# EAGLE design Arduino Nano Servo Control Shield (EAGLE 9.6.2)
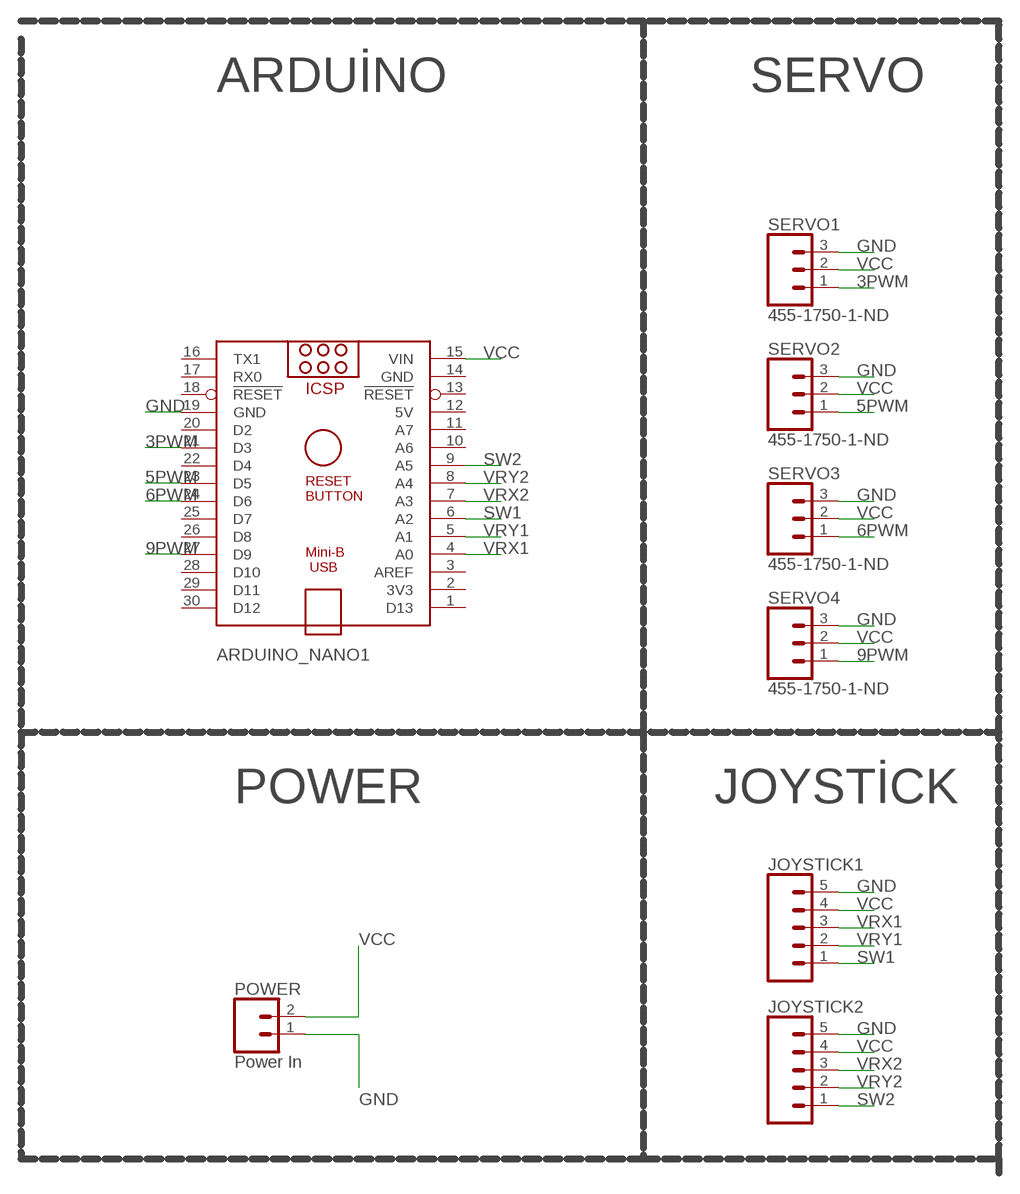
[diagram p0: schematic, sheet 1]

## Parts
ARDUINO_NANO1  ARDUINO_NANO  [ARDUINO_NANO]
JOYSTICK1  CONN_05PTH  [1X05]
JOYSTICK2  CONN_05PTH  [1X05]
POWER  Power In  CONN_023.5MM  [SCREWTERMINAL-3.5MM-2]
SERVO1  455-1750-1-ND  CONN_03  [1X03]
SERVO2  455-1750-1-ND  CONN_03  [1X03]
SERVO3  455-1750-1-ND  CONN_03  [1X03]
SERVO4  455-1750-1-ND  CONN_03  [1X03]

## Nets
3PWM: ARDUINO_NANO1.21(D3) SERVO1.1
5PWM: ARDUINO_NANO1.23(D5) SERVO2.1
6PWM: ARDUINO_NANO1.24(D6) SERVO3.1
9PWM: ARDUINO_NANO1.27(D9) SERVO4.1
GND: ARDUINO_NANO1.19(GND) JOYSTICK1.5 JOYSTICK2.5 POWER.1 SERVO1.3 SERVO2.3 SERVO3.3 SERVO4.3
SW1: ARDUINO_NANO1.6(A2) JOYSTICK1.1
SW2: ARDUINO_NANO1.9(A5) JOYSTICK2.1
VCC: ARDUINO_NANO1.15(VIN) JOYSTICK1.4 JOYSTICK2.4 POWER.2 SERVO1.2 SERVO2.2 SERVO3.2 SERVO4.2
VRX1: ARDUINO_NANO1.4(A0) JOYSTICK1.3
VRX2: ARDUINO_NANO1.7(A3) JOYSTICK2.3
VRY1: ARDUINO_NANO1.5(A1) JOYSTICK1.2
VRY2: ARDUINO_NANO1.8(A4) JOYSTICK2.2
Unconnected: ARDUINO_NANO1.1(D13) ARDUINO_NANO1.2(3V3) ARDUINO_NANO1.3(AREF) ARDUINO_NANO1.10(A6) ARDUINO_NANO1.11(A7) ARDUINO_NANO1.13(!RESET) ARDUINO_NANO1.16(TX1) ARDUINO_NANO1.17(RX0) ARDUINO_NANO1.18(!RESET) ARDUINO_NANO1.20(D2) ARDUINO_NANO1.22(D4) ARDUINO_NANO1.25(D7) ARDUINO_NANO1.26(D8) ARDUINO_NANO1.28(D10) ARDUINO_NANO1.29(D11) ARDUINO_NANO1.30(D12)

## Notes on the sheet
- ARDUİNO | SERVO
- POWER | JOYSTİCK

## Power pins joined to a net without a drawn wire
GND: ARDUINO_NANO1.14(GND)
VCC: ARDUINO_NANO1.12(5V)

## Library data of the parts
ARDUINO_NANO1 = ArduinoNanoV30:ARDUINO_NANO: Arduino Nano V3.0 Overview: The Arduino Nano is a small, complete, and breadboard-friendly board based on the ATmega328 (Arduino Nano 3.x) or ATmega168 (Arduino Nano 2.x). It has more or less the same functionality of the Arduino Duemilanove, but in a different package. It lacks only a DC power jack, and works with a Mini-B USB cable instead of a standard one. The Nano was designed and is being produced by Gravitech. Specifications: Microcontroller Atmel ATmega168 or ATmega328 Operating Voltage (logic level) 5 V Input Voltage (recommended) 7-12 V Input Voltage (limits) 6-20 V Digital I/O Pins 14 (of which 6 provide PWM output) Analog Input Pins 8 DC Current per I/O Pin 40 mA Flash Memory 16 KB (ATmega168) or 32 KB (ATmega328) of which 2 KB used by bootloader SRAM 1 KB (ATmega168) or 2 KB (ATmega328) EEPROM 512 bytes (ATmega168) or 1 KB (ATmega328) Clock Speed 16 MHz Dimensions 0.73" x 1.70" Length 45 mm Width 18 mm Weigth 5 g Power: The Arduino Nano can be powered via the Mini-B USB connection, 6-20V unregulated external power supply (pin 30), or 5V regulated external power supply (pin 27). The power source is automatically selected to the highest voltage source. Memory: The ATmega168 has 16 KB of flash memory for storing code (of which 2 KB is used for the bootloader); the ATmega328 has 32 KB, (also with 2 KB used for the bootloader). The ATmega168 has 1 KB of SRAM and 512 bytes of EEPROM (which can be read and written with the EEPROM library); the ATmega328 has 2 KB of SRAM and 1 KB of EEPROM. Input and Output: Each of the 14 digital pins on the Nano can be used as an input or output, using pinMode(), digitalWrite(), and digitalRead() functions. They operate at 5 volts. Each pin can provide or receive a maximum of 40 mA and has an internal pull-up resistor (disconnected by default) of 20-50 kOhms. In addition, some pins have specialized functions. Visit Arduino - ArduinoBoardNano <https://www.arduino.cc/en/Main/ArduinoBoardNano>
JOYSTICK1 JOYSTICK2 = SparkFun-Connectors:CONN_05: Multi connection point. Often used as Generic Header-pin footprint for 0.1 inch spaced/style header connections On any of the 0.1 inch spaced packages, you can populate with these: Break Away Headers - Straight <https://www.sparkfun.com/products/116> (PRT-00116) Break Away Male Headers - Right Angle <https://www.sparkfun.com/products/553> (PRT-00553) Female Headers <https://www.sparkfun.com/products/115> (PRT-00115) Break Away Headers - Machine Pin <https://www.sparkfun.com/products/117> (PRT-00117) Break Away Female Headers - Swiss Machine Pin <https://www.sparkfun.com/products/743> (PRT-00743) For SCREWTERMINALS and SPRING TERMINALS visit here: Screw Terimnals on SparkFun.com <https://www.sparkfun.com/search/results?term=Screw+Terminals> (5mm/3.5mm/2.54mm spacing) This device is also useful as a general connection point to wire up your design to another part of your project. Our various solder wires solder well into these plated through hole pads. Hook-Up Wire - Assortment (Stranded, 22 AWG) <https://www.sparkfun.com/products/11375> (PRT-11375) Hook-Up Wire - Assortment (Solid Core, 22 AWG) <https://www.sparkfun.com/products/11367> (PRT-11367) View the entire wire category on our website here <https://www.sparkfun.com/categories/141> Special notes: Molex polarized connector foot print use with SKU : PRT-08231 with associated crimp pins and housings. 1MM SMD Version SKU: PRT-10208
POWER = SparkFun-Connectors:CONN_02: Multi connection point. Often used as Generic Header-pin footprint for 0.1 inch spaced/style header connections On any of the 0.1 inch spaced packages, you can populate with these: Break Away Headers - Straight <https://www.sparkfun.com/products/116> (PRT-00116) Break Away Male Headers - Right Angle <https://www.sparkfun.com/products/553> (PRT-00553) Female Headers <https://www.sparkfun.com/products/115> (PRT-00115) Break Away Headers - Machine Pin <https://www.sparkfun.com/products/117> (PRT-00117) Break Away Female Headers - Swiss Machine Pin <https://www.sparkfun.com/products/743> (PRT-00743) For SCREWTERMINALS and SPRING TERMINALS visit here: Screw Terimnals on SparkFun.com <https://www.sparkfun.com/search/results?term=Screw+Terminals> (5mm/3.5mm/2.54mm spacing) This device is also useful as a general connection point to wire up your design to another part of your project. Our various solder wires solder well into these plated through hole pads. Hook-Up Wire - Assortment (Stranded, 22 AWG) <https://www.sparkfun.com/products/11375> (PRT-11375) Hook-Up Wire - Assortment (Solid Core, 22 AWG) <https://www.sparkfun.com/products/11367> (PRT-11367) View the entire wire category on our website here <https://www.sparkfun.com/categories/141> Special notes: Molex polarized connector foot print use with: PRT-08233 with associated crimp pins and housings. 2.54_SCREWTERM for use with PRT-10571. 3.5mm Screw Terminal footprints for PRT-08084 5mm Screw Terminal footprints for use with PRT-08432; PROD_ID: CONN-08399
SERVO1-SERVO4 = SparkFun-Connectors:CONN_03: Multi connection point. Often used as Generic Header-pin footprint for 0.1 inch spaced/style header connections On any of the 0.1 inch spaced packages, you can populate with these: Break Away Headers - Straight <https://www.sparkfun.com/products/116> (PRT-00116) Break Away Male Headers - Right Angle <https://www.sparkfun.com/products/553> (PRT-00553) Female Headers <https://www.sparkfun.com/products/115> (PRT-00115) Break Away Headers - Machine Pin <https://www.sparkfun.com/products/117> (PRT-00117) Break Away Female Headers - Swiss Machine Pin <https://www.sparkfun.com/products/743> (PRT-00743) Stackable Header - 3 Pin (Female, 0.1") <https://www.sparkfun.com/products/13875> (PRT-13875) For SCREWTERMINALS and SPRING TERMINALS visit here: Screw Terimnals on SparkFun.com <https://www.sparkfun.com/search/results?term=Screw+Terminals> (5mm/3.5mm/2.54mm spacing) This device is also useful as a general connection point to wire up your design to another part of your project. Our various solder wires solder well into these plated through hole pads. Hook-Up Wire - Assortment (Stranded, 22 AWG) <https://www.sparkfun.com/products/11375> (PRT-11375) Hook-Up Wire - Assortment (Solid Core, 22 AWG) <https://www.sparkfun.com/products/11367> (PRT-11367) View the entire wire category on our website here <https://www.sparkfun.com/categories/141> Special notes: Molex polarized connector foot print use with SKU : PRT-08232 with associated crimp pins and housings.; PROD_ID: XXX-00000

## Board
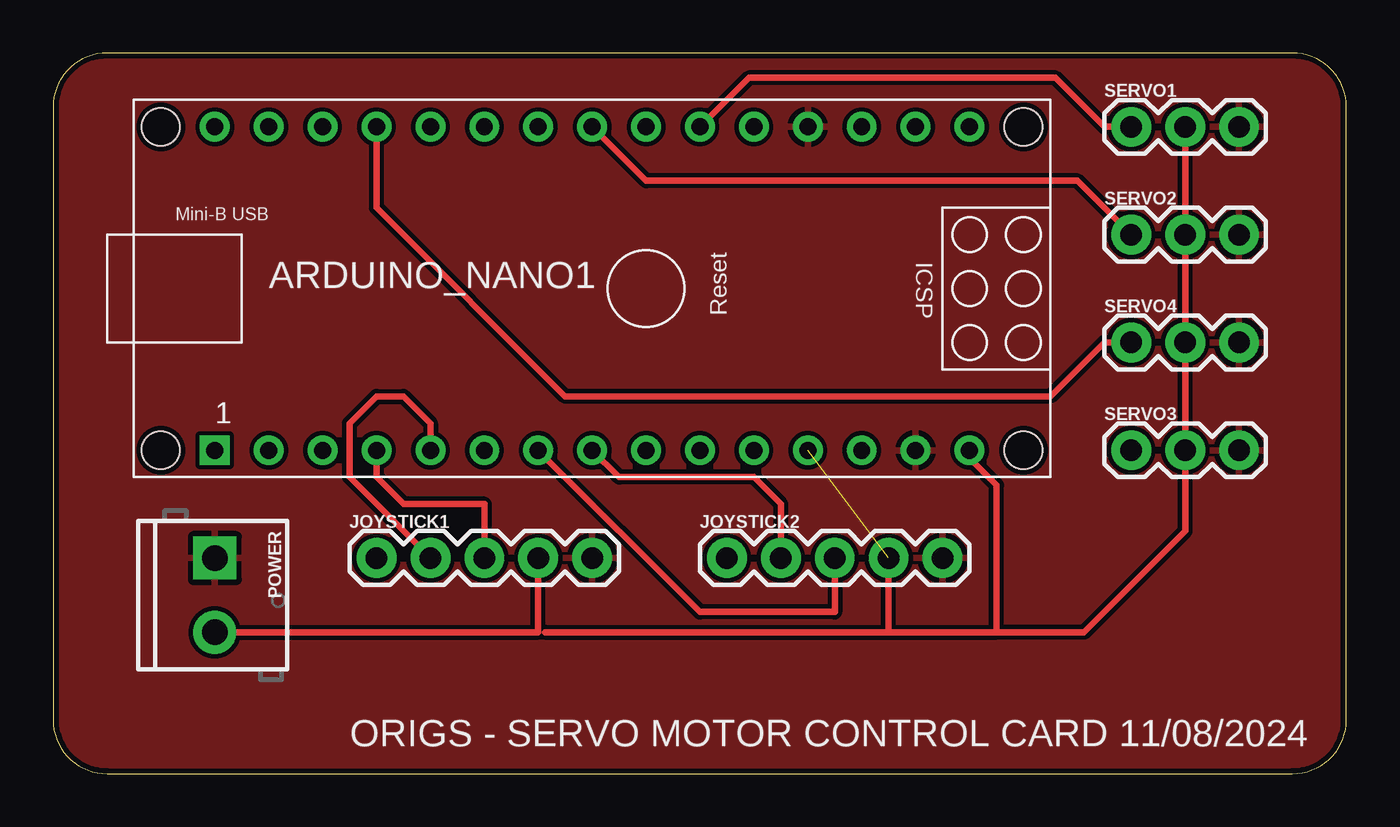
[diagram p1: board, top side]
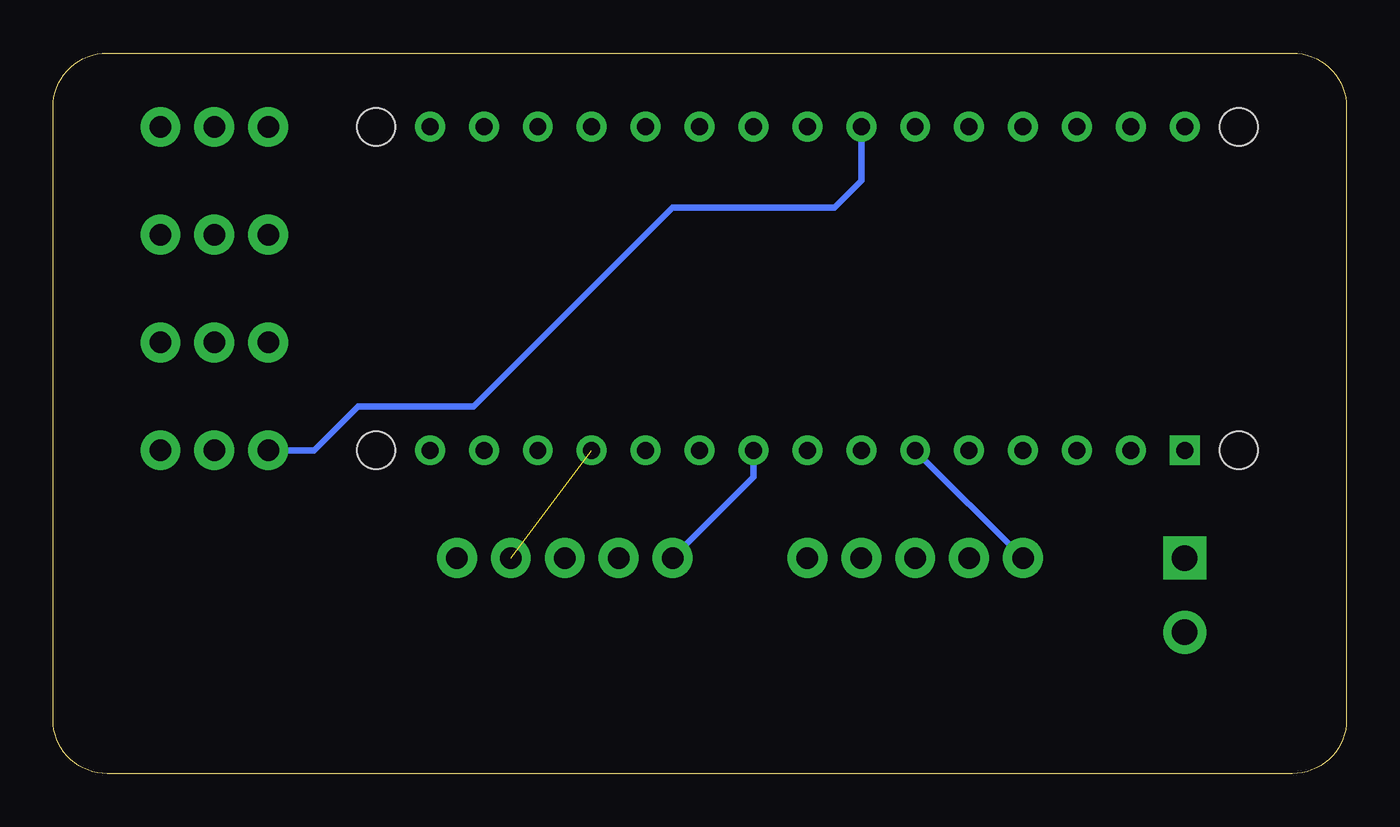
[diagram p2: board, bottom side, seen from below]

Size 60.94 x 33.96 mm. Coordinates in mm from the lower left corner, seen from the top.
Outline: 0,31.42 0,2.54 arc90 2.54,0 58.4,0 arc90 60.94,2.54 60.94,31.42 arc90 58.4,33.96 2.54,33.96 arc90 0,31.42
Copper layers (1*16): Top 0.035mm / dielectric 1.5mm / Bottom 0.035mm
Design rules "SparkFun": minimum track width 8mil, minimum drill 20mil, track to track 8mil, track to pad 8mil, pad to pad 8mil, via to via 8mil, smd to smd 8mil, copper to edge 10mil, drill to drill 8mil, minimum pad ring 12mil, minimum via ring 10mil, stop-mask expansion 4mil, vias tented up to drill 25mil, thermal gap 10mil

### Footprints (pad centres in the part's own frame; a part is rotated, then mirrored left to right if it is on the bottom)
ARDUINO_NANO = drill 0.8 square: 1 -20.32,-7.62 | drill 0.8: 2 -17.78,-7.62; 3 -15.24,-7.62; 4 -12.7,-7.62; 5 -10.16,-7.62; 6 -7.62,-7.62; 7 -5.08,-7.62; 8 -2.54,-7.62; 9 0,-7.62; 10 2.54,-7.62; 11 5.08,-7.62; 12 7.62,-7.62; 13 10.16,-7.62; 14 12.7,-7.62; 15 15.24,-7.62; 16 15.24,7.62; 17 12.7,7.62; 18 10.16,7.62; 19 7.62,7.62; 20 5.08,7.62; 21 2.54,7.62; 22 0,7.62; 23 -2.54,7.62; 24 -5.08,7.62; 25 -7.62,7.62; 26 -10.16,7.62; 27 -12.7,7.62; 28 -15.24,7.62; 29 -17.78,7.62; 30 -20.32,7.62 | hole 1.778: -22.86,-7.62; -22.86,7.62; 17.78,7.62; 17.78,-7.62
1X05 = drill 1.016 pad 1.88: 1 0,0; 2 2.54,0; 3 5.08,0; 4 7.62,0; 5 10.16,0
SCREWTERMINAL-3.5MM-2 = drill 1.2 pad 2.032 square: 1 0,0 | drill 1.2 pad 2.032: 2 3.5,0
1X03 = drill 1.016 pad 1.88: 1 0,0; 2 2.54,0; 3 5.08,0

### Placement (x,y rotation side)
ARDUINO_NANO1  27.94,22.86 0 top
JOYSTICK1  15.24,10.16 0 top
JOYSTICK2  31.75,10.16 0 top
POWER  7.62,10.16 270 top
SERVO1  50.8,30.48 0 top
SERVO2  50.8,25.4 0 top
SERVO3  50.8,15.24 0 top
SERVO4  50.8,20.32 0 top

### Tracks (layer width: path | path; a pad name or v marks a point on that pad's centre or on a via)
3PWM
  Top 0.305: SERVO1.1 49.53,30.48 47.22,32.79 32.79,32.79 ARDUINO_NANO1.21
5PWM
  Top 0.305: SERVO2.1 48.26,27.94 27.94,27.94 ARDUINO_NANO1.23
6PWM
  Bottom 0.305: SERVO3.1 48.63,15.24 46.57,17.3 41.12,17.3 31.75,26.67 24.13,26.67 22.86,27.94 ARDUINO_NANO1.24
9PWM
  Top 0.305: SERVO4.1 49.53,20.32 46.99,17.78 24.13,17.78 15.24,26.67 ARDUINO_NANO1.27
GND
  pour Top: -2.54,35.56 -2.54,-1.27 64.77,-1.27 64.77,38.1 0,38.1
SW1
  Bottom 0.305: JOYSTICK1.1 ARDUINO_NANO1.6
SW2
  Bottom 0.305: ARDUINO_NANO1.9 27.94,13.97 JOYSTICK2.1
VCC  (1 unrouted)
  Top 0.305: POWER.2 22.86,6.66 JOYSTICK1.4 | 44.45,6.66 48.57,6.66 53.34,11.43 SERVO3.2 SERVO4.2 SERVO2.2 SERVO1.2 | 44.45,6.66 44.45,13.6 43.18,14.87 ARDUINO_NANO1.15 | 23.17,6.66 39.37,6.66 | 39.37,6.66 44.45,6.66 | 39.37,6.66 JOYSTICK2.4
VRX1
  Top 0.305: JOYSTICK1.3 20.32,12.7 16.51,12.7 15.24,13.97 ARDUINO_NANO1.4
VRX2
  Top 0.305: JOYSTICK2.3 36.83,7.62 30.48,7.62 ARDUINO_NANO1.7
VRY1
  Top 0.305: JOYSTICK1.2 13.97,13.97 13.97,16.51 15.24,17.78 16.51,17.78 17.78,16.51 ARDUINO_NANO1.5
VRY2
  Top 0.305: JOYSTICK2.2 34.29,12.7 33.02,13.97 26.67,13.97 ARDUINO_NANO1.8

### Text on the board
tPlace: ORIGS - SERVO MOTOR CONTROL CARD 11/08/2024